# Altium schematic sheet fpga-ground.SchDoc: FPGA - Ground
size Legal; CheckedBy: J. Brinton; CompanyName: Signal Laboratories, Inc.; DrawnBy: J. Brinton; Engineer: J. Brinton; Address1: 3479 Edison Way; Address2: Menlo Park CA 94025; Address3: +1 (877) 778-8435; Address4: siglabs.com; DocumentNumber: 35; Revision: 2b; SheetNumber: 36; SheetTotal: 58
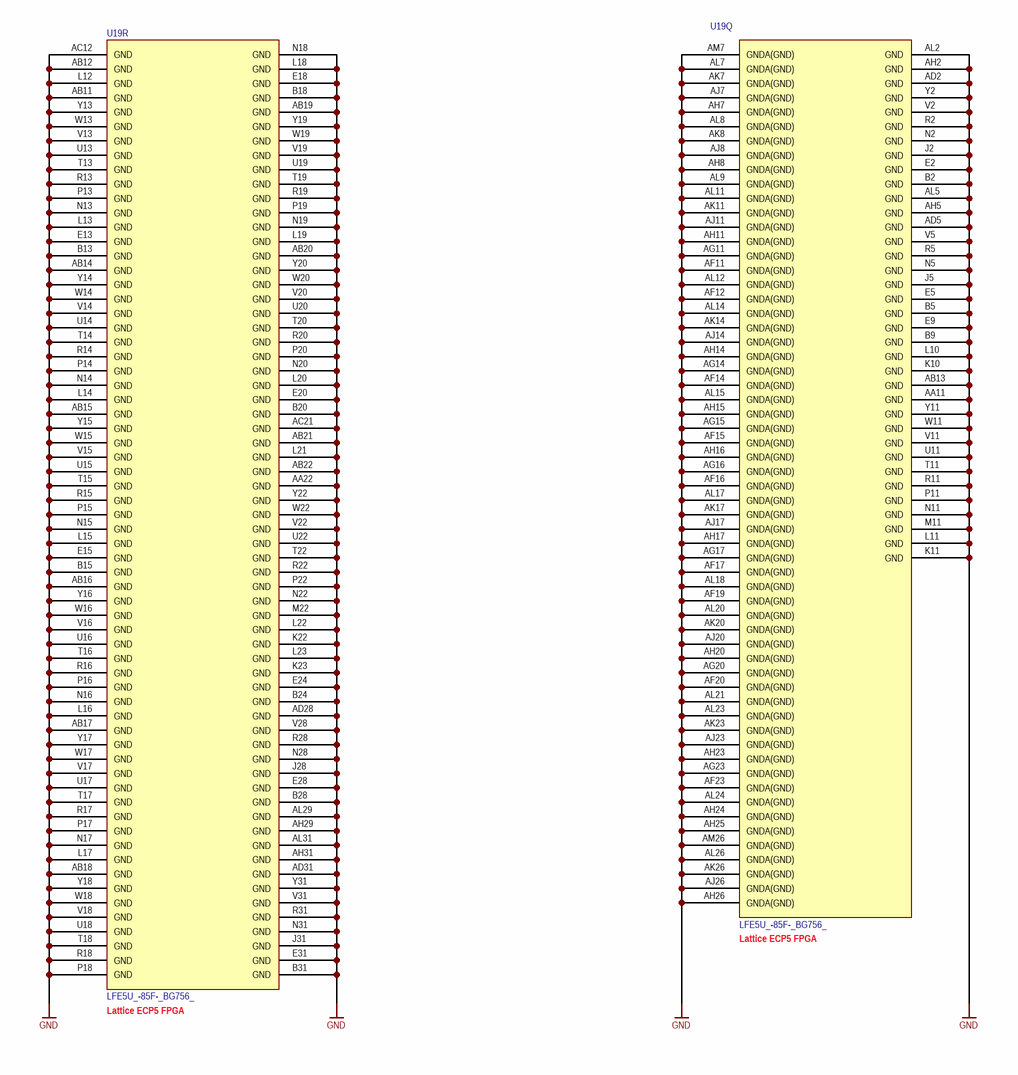
[diagram p0: fpga-ground.SchDoc]

## Parts
U19  LFE5U_-85F-_BG756_  [caBGA756]  (parts Q,R of 19)

## Nets
GND: U19.AA11(GND) U19.AA22(GND) U19.AB11(GND) U19.AB12(GND) U19.AB13(GND) U19.AB14(GND) U19.AB15(GND) U19.AB16(GND) U19.AB17(GND) U19.AB18(GND) U19.AB19(GND) U19.AB20(GND) U19.AB21(GND) U19.AB22(GND) U19.AC12(GND) U19.AC21(GND) U19.AD2(GND) U19.AD5(GND) U19.AD28(GND) U19.AD31(GND) U19.AF11(GNDA(GND)) U19.AF12(GNDA(GND)) U19.AF14(GNDA(GND)) U19.AF15(GNDA(GND)) U19.AF16(GNDA(GND)) U19.AF17(GNDA(GND)) U19.AF19(GNDA(GND)) U19.AF20(GNDA(GND)) U19.AF23(GNDA(GND)) U19.AG11(GNDA(GND)) U19.AG14(GNDA(GND)) U19.AG15(GNDA(GND)) U19.AG16(GNDA(GND)) U19.AG17(GNDA(GND)) U19.AG20(GNDA(GND)) U19.AG23(GNDA(GND)) U19.AH2(GND) U19.AH5(GND) U19.AH7(GNDA(GND)) U19.AH8(GNDA(GND)) U19.AH11(GNDA(GND)) U19.AH14(GNDA(GND)) U19.AH15(GNDA(GND)) U19.AH16(GNDA(GND)) U19.AH17(GNDA(GND)) U19.AH20(GNDA(GND)) U19.AH23(GNDA(GND)) U19.AH24(GNDA(GND)) U19.AH25(GNDA(GND)) U19.AH26(GNDA(GND)) U19.AH29(GND) U19.AH31(GND) U19.AJ7(GNDA(GND)) U19.AJ8(GNDA(GND)) U19.AJ11(GNDA(GND)) U19.AJ14(GNDA(GND)) U19.AJ17(GNDA(GND)) U19.AJ20(GNDA(GND)) U19.AJ23(GNDA(GND)) U19.AJ26(GNDA(GND)) U19.AK7(GNDA(GND)) U19.AK8(GNDA(GND)) U19.AK11(GNDA(GND)) U19.AK14(GNDA(GND)) U19.AK17(GNDA(GND)) U19.AK20(GNDA(GND)) U19.AK23(GNDA(GND)) U19.AK26(GNDA(GND)) U19.AL2(GND) U19.AL5(GND) U19.AL7(GNDA(GND)) U19.AL8(GNDA(GND)) U19.AL9(GNDA(GND)) U19.AL11(GNDA(GND)) U19.AL12(GNDA(GND)) U19.AL14(GNDA(GND)) U19.AL15(GNDA(GND)) U19.AL17(GNDA(GND)) U19.AL18(GNDA(GND)) U19.AL20(GNDA(GND)) U19.AL21(GNDA(GND)) U19.AL23(GNDA(GND)) U19.AL24(GNDA(GND)) U19.AL26(GNDA(GND)) U19.AL29(GND) U19.AL31(GND) U19.AM7(GNDA(GND)) U19.AM26(GNDA(GND)) U19.B2(GND) U19.B5(GND) U19.B9(GND) U19.B13(GND) U19.B15(GND) U19.B18(GND) U19.B20(GND) U19.B24(GND) U19.B28(GND) U19.B31(GND) U19.E2(GND) U19.E5(GND) U19.E9(GND) U19.E13(GND) U19.E15(GND) U19.E18(GND) U19.E20(GND) U19.E24(GND) U19.E28(GND) U19.E31(GND) U19.J2(GND) U19.J5(GND) U19.J28(GND) U19.J31(GND) U19.K10(GND) U19.K11(GND) U19.K22(GND) U19.K23(GND) U19.L10(GND) U19.L11(GND) U19.L12(GND) U19.L13(GND) U19.L14(GND) U19.L15(GND) U19.L16(GND) U19.L17(GND) U19.L18(GND) U19.L19(GND) U19.L20(GND) U19.L21(GND) U19.L22(GND) U19.L23(GND) U19.M11(GND) U19.M22(GND) U19.N2(GND) U19.N5(GND) U19.N11(GND) U19.N13(GND) U19.N14(GND) U19.N15(GND) U19.N16(GND) U19.N17(GND) U19.N18(GND) U19.N19(GND) U19.N20(GND) U19.N22(GND) U19.N28(GND) U19.N31(GND) U19.P11(GND) U19.P13(GND) U19.P14(GND) U19.P15(GND) U19.P16(GND) U19.P17(GND) U19.P18(GND) U19.P19(GND) U19.P20(GND) U19.P22(GND) U19.R2(GND) U19.R5(GND) U19.R11(GND) U19.R13(GND) U19.R14(GND) U19.R15(GND) U19.R16(GND) U19.R17(GND) U19.R18(GND) U19.R19(GND) U19.R20(GND) U19.R22(GND) U19.R28(GND) U19.R31(GND) U19.T11(GND) U19.T13(GND) U19.T14(GND) U19.T15(GND) U19.T16(GND) U19.T17(GND) U19.T18(GND) U19.T19(GND) U19.T20(GND) U19.T22(GND) U19.U11(GND) U19.U13(GND) U19.U14(GND) U19.U15(GND) U19.U16(GND) U19.U17(GND) U19.U18(GND) U19.U19(GND) U19.U20(GND) U19.U22(GND) U19.V2(GND) U19.V5(GND) U19.V11(GND) U19.V13(GND) U19.V14(GND) U19.V15(GND) U19.V16(GND) U19.V17(GND) U19.V18(GND) U19.V19(GND) U19.V20(GND) U19.V22(GND) U19.V28(GND) U19.V31(GND) U19.W11(GND) U19.W13(GND) U19.W14(GND) U19.W15(GND) U19.W16(GND) U19.W17(GND) U19.W18(GND) U19.W19(GND) U19.W20(GND) U19.W22(GND) U19.Y2(GND) U19.Y11(GND) U19.Y13(GND) U19.Y14(GND) U19.Y15(GND) U19.Y16(GND) U19.Y17(GND) U19.Y18(GND) U19.Y19(GND) U19.Y20(GND) U19.Y22(GND) U19.Y31(GND)

## Notes on the sheet
- (near U19) Lattice ECP5 FPGA
- Title
- Engineer
- Revision
- Drawn By
- Checked By
- Date
- Sheet
- of

## Library data of the parts
U19 = LFE5U_-85F-_BG756_: ECP5 FPGA, 85k LUT, 756-caBGA; Manufacturer: Lattice Semiconductor; Manufacturer P/N: LFE5U_-85F-_BG756_